# Altium schematic sheet GMSL_DESERIALIZER.SchDoc
size C; SheetNumber: 13; SheetTotal: 17
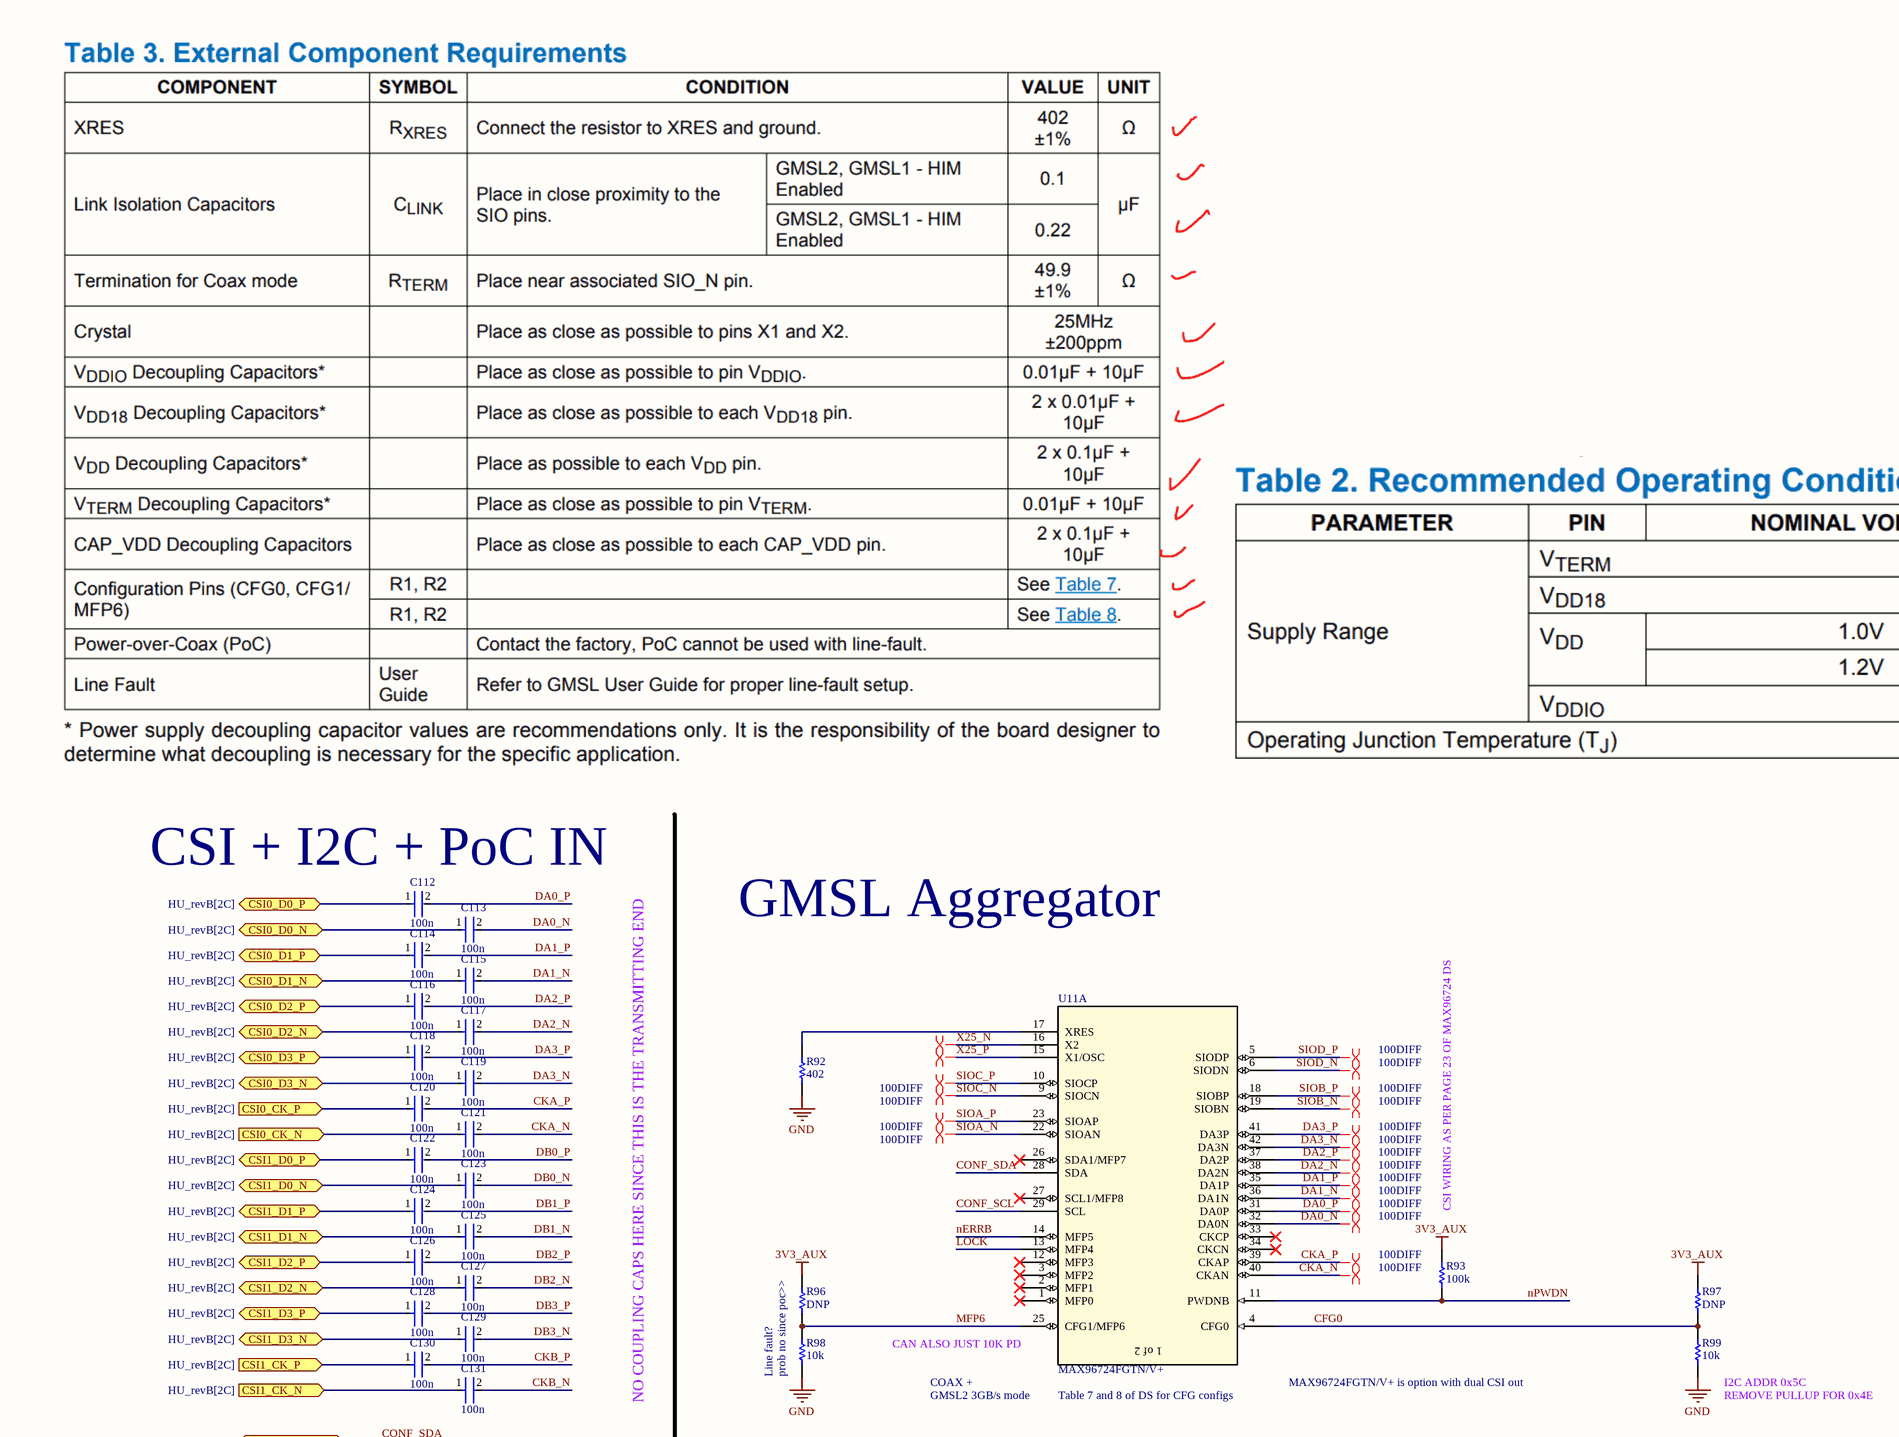
[diagram p0: GMSL_DESERIALIZER.SchDoc, top left]
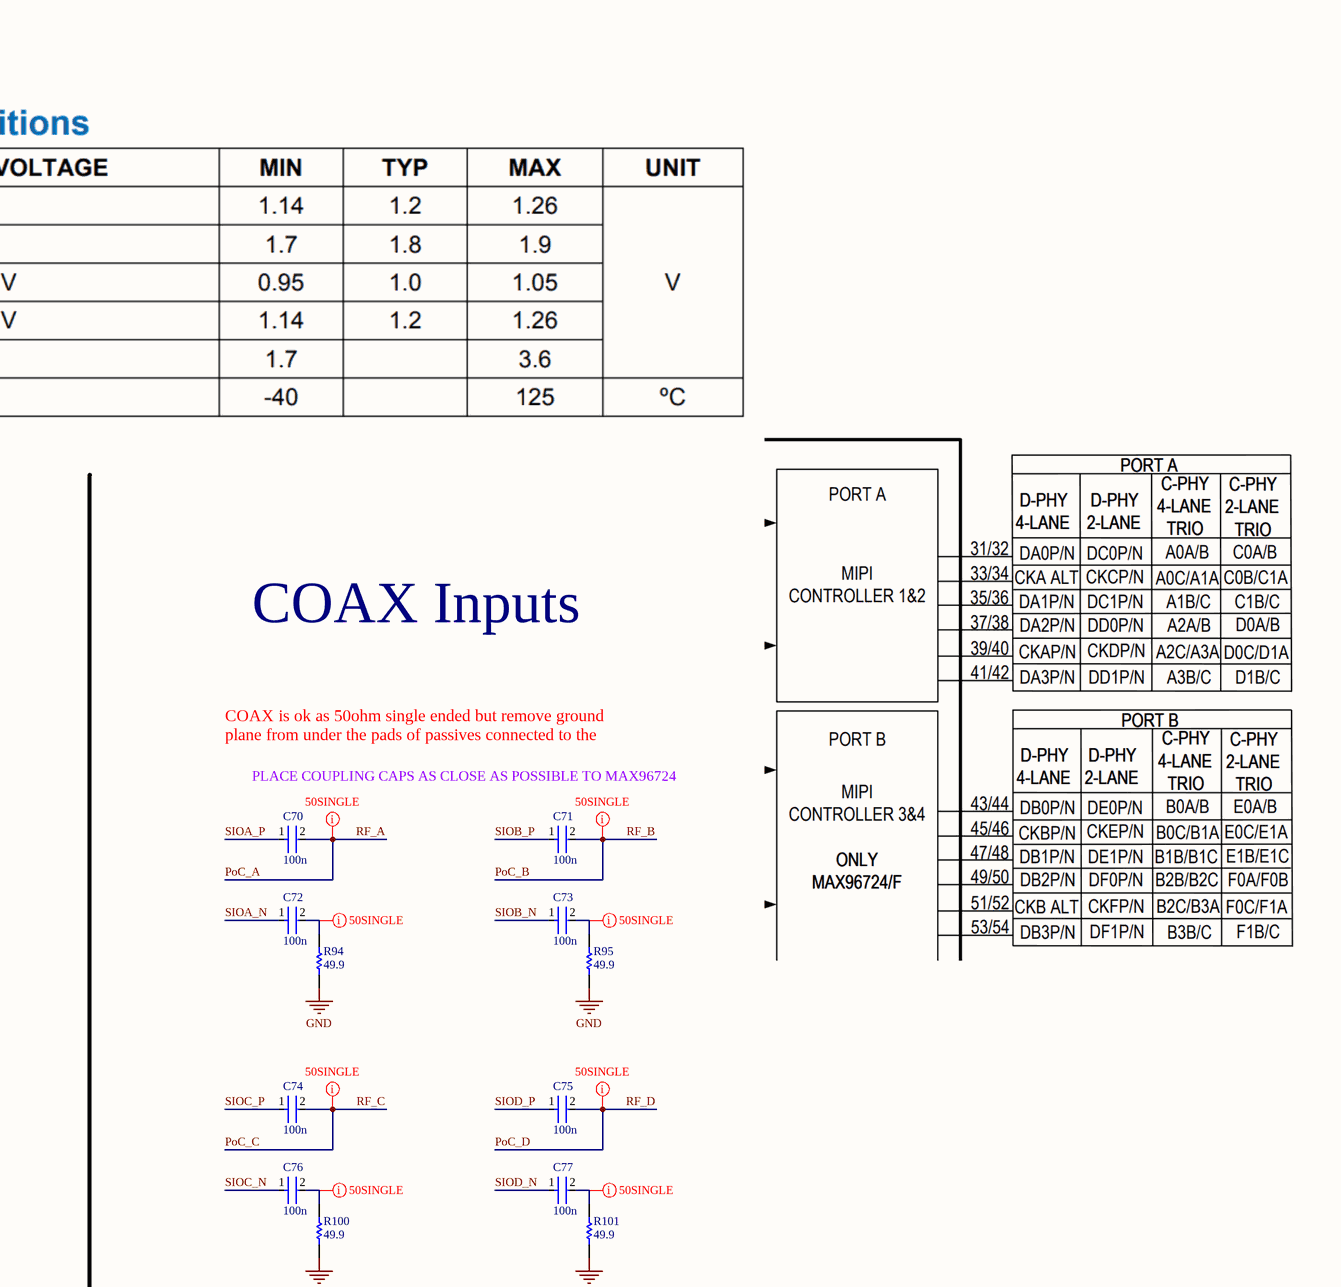
[diagram p1: GMSL_DESERIALIZER.SchDoc, top right]
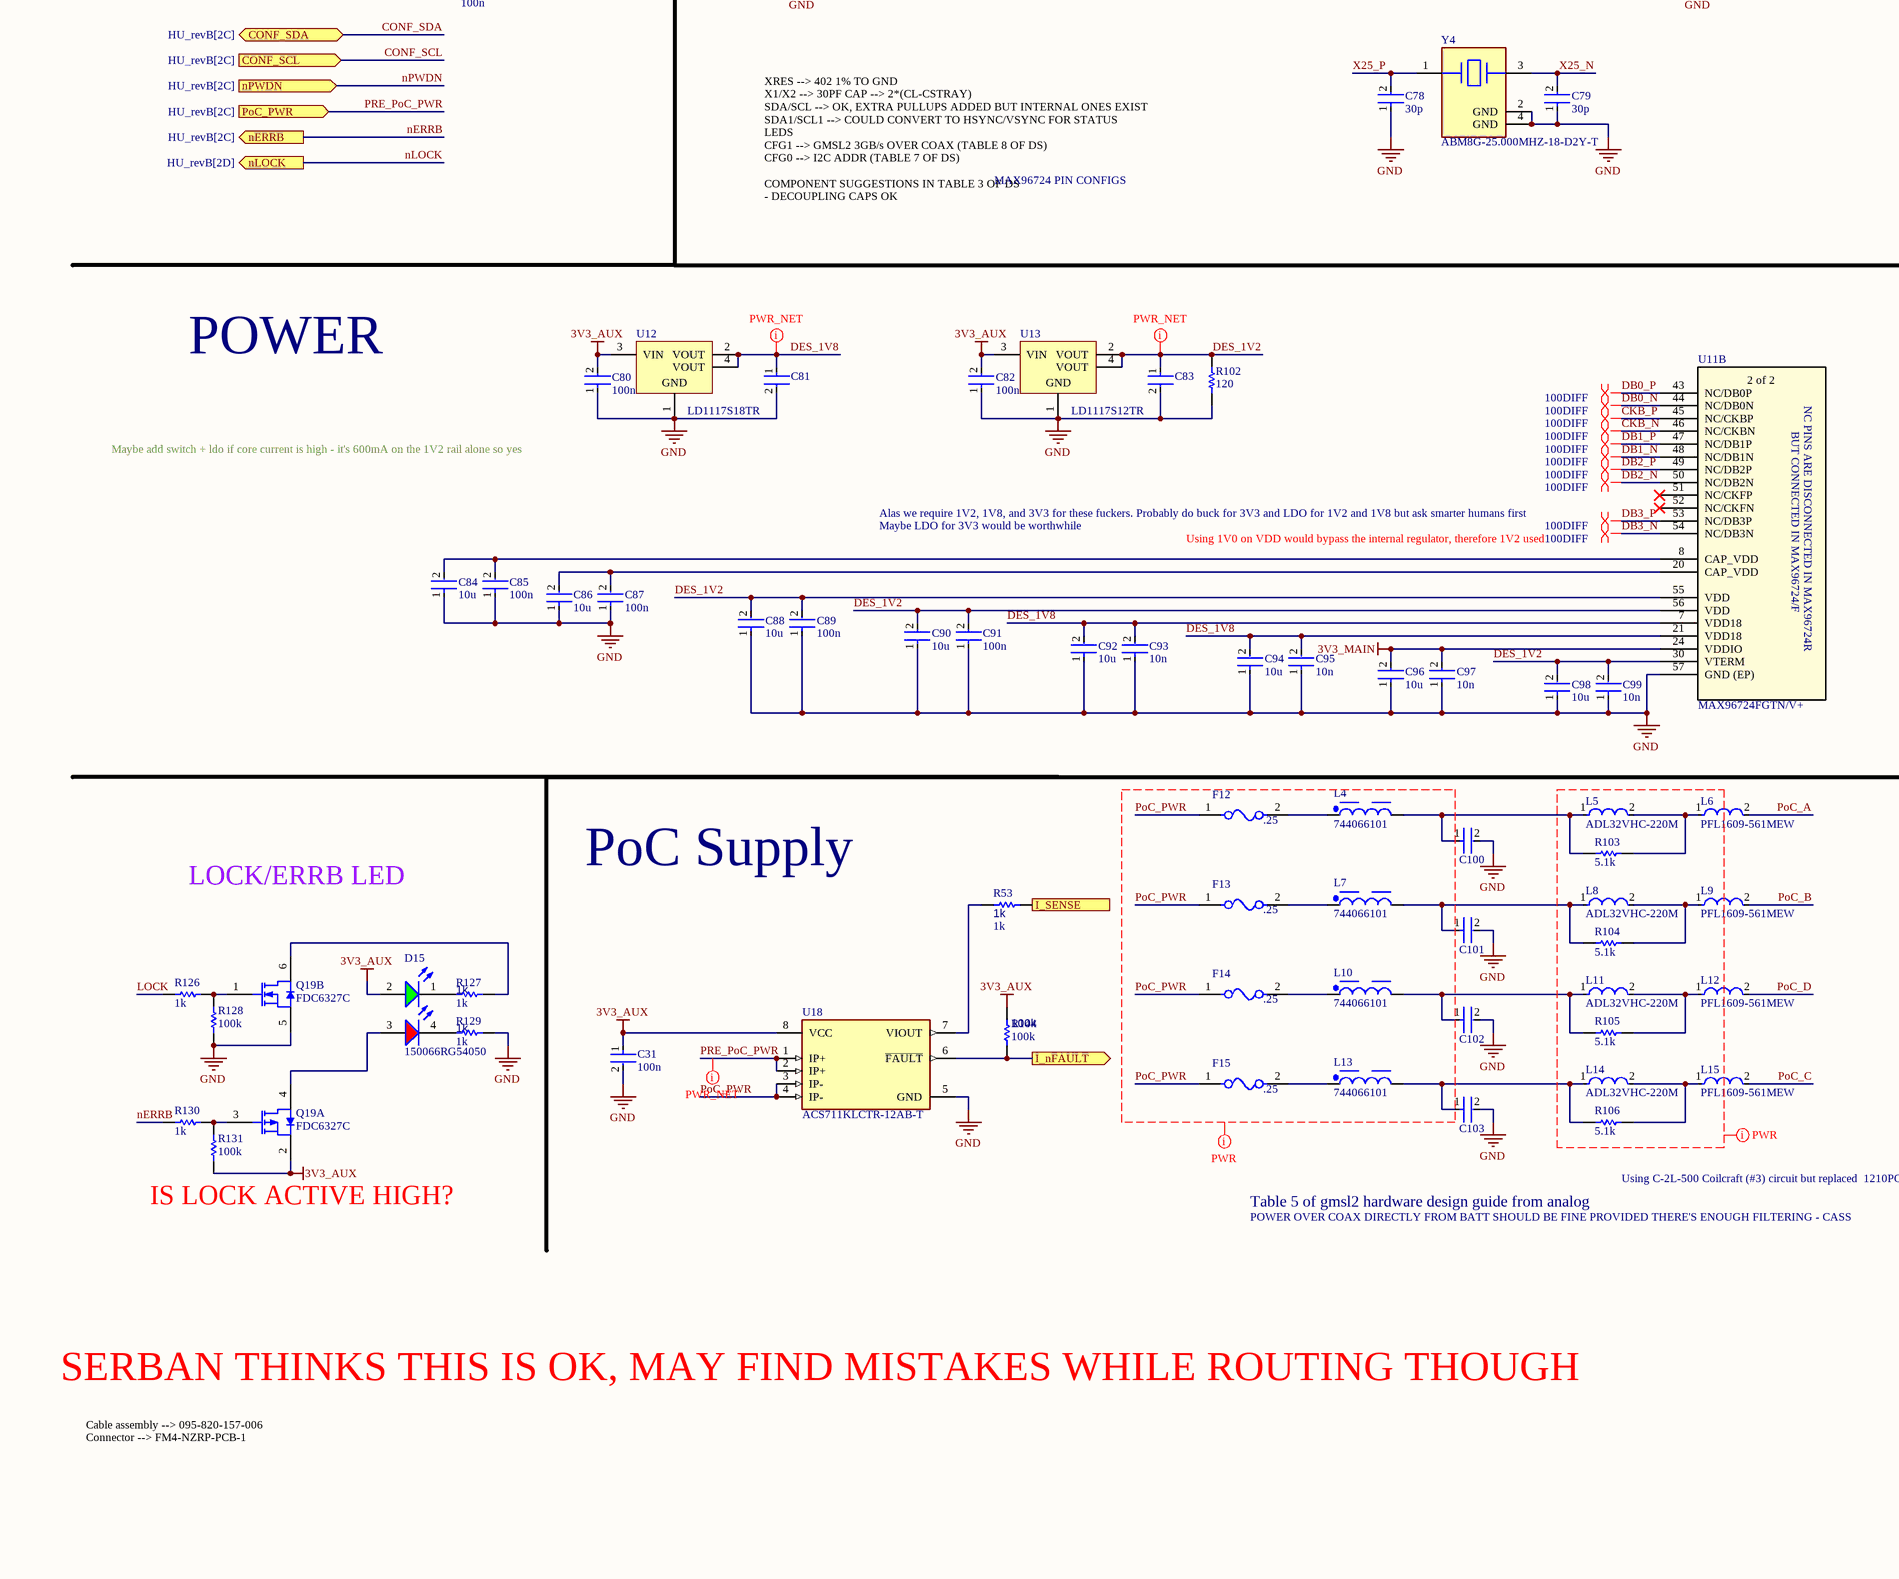
[diagram p2: GMSL_DESERIALIZER.SchDoc, bottom left]
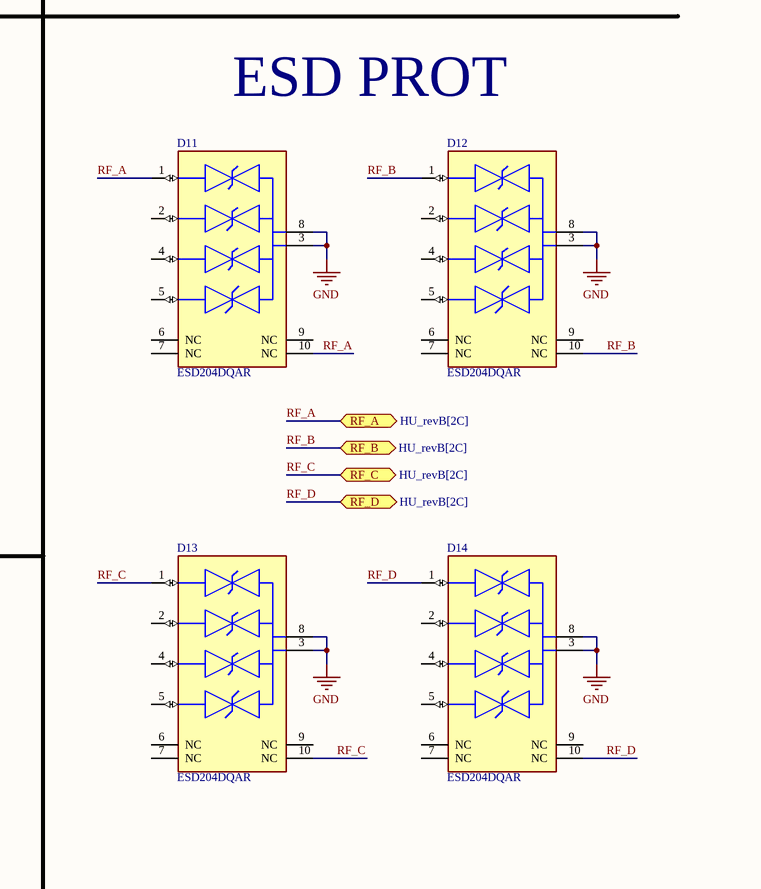
[diagram p3: GMSL_DESERIALIZER.SchDoc, bottom right]

## Parts
C31  100n  [FP-0402-L_1_0_0_05-W_0_5-IPC_A]
C70  100n  [FP-0402-L_1_0_0_05-W_0_5-IPC_A]
C71  100n  [FP-0402-L_1_0_0_05-W_0_5-IPC_A]
C72  100n  [FP-0402-L_1_0_0_05-W_0_5-IPC_A]
C73  100n  [FP-0402-L_1_0_0_05-W_0_5-IPC_A]
C74  100n  [FP-0402-L_1_0_0_05-W_0_5-IPC_A]
C75  100n  [FP-0402-L_1_0_0_05-W_0_5-IPC_A]
C76  100n  [FP-0402-L_1_0_0_05-W_0_5-IPC_A]
C77  100n  [FP-0402-L_1_0_0_05-W_0_5-IPC_A]
C78  30p  [FP-0402-L_1_0_0_05-W_0_5-IPC_A]
C79  30p  [FP-0402-L_1_0_0_05-W_0_5-IPC_A]
C80  100n  [FP-0402-L_1_0_0_05-W_0_5-IPC_A]
C81  GRM188R60J106ME47D  [FP-GRM188-0_1-e0_2_0_55-IPC_A]  (value not drawn)
C82  100n  [FP-0402-L_1_0_0_05-W_0_5-IPC_A]
C83  GRM188R60J106ME47D  [FP-GRM188-0_1-e0_2_0_55-IPC_A]  (value not drawn)
C84  10u  [FP-0402-L_1_0_0_05-W_0_5-IPC_A]
C85  100n  [FP-0402-L_1_0_0_05-W_0_5-IPC_A]
C86  10u  [FP-0402-L_1_0_0_05-W_0_5-IPC_A]
C87  100n  [FP-0402-L_1_0_0_05-W_0_5-IPC_A]
C88  10u  [FP-0402-L_1_0_0_05-W_0_5-IPC_A]
C89  100n  [FP-0402-L_1_0_0_05-W_0_5-IPC_A]
C90  10u  [FP-0402-L_1_0_0_05-W_0_5-IPC_A]
C91  100n  [FP-0402-L_1_0_0_05-W_0_5-IPC_A]
C92  10u  [FP-0402-L_1_0_0_05-W_0_5-IPC_A]
C93  10n  [FP-0402-L_1_0_0_05-W_0_5-IPC_A]
C94  10u  [FP-0402-L_1_0_0_05-W_0_5-IPC_A]
C95  10n  [FP-0402-L_1_0_0_05-W_0_5-IPC_A]
C96  10u  [FP-0402-L_1_0_0_05-W_0_5-IPC_A]
C97  10n  [FP-0402-L_1_0_0_05-W_0_5-IPC_A]
C98  10u  [FP-0402-L_1_0_0_05-W_0_5-IPC_A]
C99  10n  [FP-0402-L_1_0_0_05-W_0_5-IPC_A]
C100  GRM21BR61E226ME44L  [FP-GRM21B-0_2-e0_2_0_7-IPC_B]  (value not drawn)
C101  GRM21BR61E226ME44L  [FP-GRM21B-0_2-e0_2_0_7-IPC_B]  (value not drawn)
C102  GRM21BR61E226ME44L  [FP-GRM21B-0_2-e0_2_0_7-IPC_B]  (value not drawn)
C103  GRM21BR61E226ME44L  [FP-GRM21B-0_2-e0_2_0_7-IPC_B]  (value not drawn)
C112  100n  [FP-0402-L_1_0_0_05-W_0_5-IPC_A]
C113  100n  [FP-0402-L_1_0_0_05-W_0_5-IPC_A]
C114  100n  [FP-0402-L_1_0_0_05-W_0_5-IPC_A]
C115  100n  [FP-0402-L_1_0_0_05-W_0_5-IPC_A]
C116  100n  [FP-0402-L_1_0_0_05-W_0_5-IPC_A]
C117  100n  [FP-0402-L_1_0_0_05-W_0_5-IPC_A]
C118  100n  [FP-0402-L_1_0_0_05-W_0_5-IPC_A]
C119  100n  [FP-0402-L_1_0_0_05-W_0_5-IPC_A]
C120  100n  [FP-0402-L_1_0_0_05-W_0_5-IPC_A]
C121  100n  [FP-0402-L_1_0_0_05-W_0_5-IPC_A]
C122  100n  [FP-0402-L_1_0_0_05-W_0_5-IPC_A]
C123  100n  [FP-0402-L_1_0_0_05-W_0_5-IPC_A]
C124  100n  [FP-0402-L_1_0_0_05-W_0_5-IPC_A]
C125  100n  [FP-0402-L_1_0_0_05-W_0_5-IPC_A]
C126  100n  [FP-0402-L_1_0_0_05-W_0_5-IPC_A]
C127  100n  [FP-0402-L_1_0_0_05-W_0_5-IPC_A]
C128  100n  [FP-0402-L_1_0_0_05-W_0_5-IPC_A]
C129  100n  [FP-0402-L_1_0_0_05-W_0_5-IPC_A]
C130  100n  [FP-0402-L_1_0_0_05-W_0_5-IPC_A]
C131  100n  [FP-0402-L_1_0_0_05-W_0_5-IPC_A]
D11  ESD204DQAR  [FP-DQA0010A-MFG]
D12  ESD204DQAR  [FP-DQA0010A-MFG]
D13  ESD204DQAR  [FP-DQA0010A-MFG]
D14  ESD204DQAR  [FP-DQA0010A-MFG]
D15  150066RG54050  [WL-SBCD_0606]
F12  .25  [FP-0685T-MFG]
F13  .25  [FP-0685T-MFG]
F14  .25  [FP-0685T-MFG]
F15  .25  [FP-0685T-MFG]
L4  744066101  [WE-TPC_1038]
L5  ADL32VHC-220M  [FP-1210POC-MFG]
L6  PFL1609-561MEW  [FP-PFL1609-MFG]
L7  744066101  [WE-TPC_1038]
L8  ADL32VHC-220M  [FP-1210POC-MFG]
L9  PFL1609-561MEW  [FP-PFL1609-MFG]
L10  744066101  [WE-TPC_1038]
L11  ADL32VHC-220M  [FP-1210POC-MFG]
L12  PFL1609-561MEW  [FP-PFL1609-MFG]
L13  744066101  [WE-TPC_1038]
L14  ADL32VHC-220M  [FP-1210POC-MFG]
L15  PFL1609-561MEW  [FP-PFL1609-MFG]
Q19  FDC6327C  [FAIR-SOT23-6_V]  (parts A,B of 2)
R53  1k  [R0603B]
R92  402  [R0603B]
R93  100k  [R0603B]
R94  49.9  [R0603B]
R95  49.9  [R0603B]
R96  DNP  [R0603B]
R97  DNP  [R0603B]
R98  10k  [R0603B]
R99  10k  [R0603B]
R100  49.9  [R0603B]
R101  49.9  [R0603B]
R102  120  [R0603B]
R103  5.1k  [R0603B]
R104  5.1k  [R0603B]
R105  5.1k  [R0603B]
R106  5.1k  [R0603B]
R126  1k  [R0603B]
R127  1k  [R0603B]
R128  100k  [R0603B]
R129  1k  [R0603B]
R130  1k  [R0603B]
R131  100k  [R0603B]
R144  100k  [R0603B]
U11  MAX96724FGTN/V+  [MAX96724FGTN_V+-Footprint-1]  (parts A,B of 2)
U12  LD1117S18TR  [SOT-223_M]
U13  LD1117S12TR  [SOT-223_M]
U18  ACS711KLCTR-12AB-T  [FP-LC-8-IPC_C]
Y4  ABM8G-25.000MHZ-18-D2Y-T  [FP-ABM8G-MFG]

## Ports
CONF_SCL (in, see HU_revB[2C]), CONF_SDA (bidir, see HU_revB[2C]), CSI0_CK_N (in, see HU_revB[2C]), CSI0_CK_P (in, see HU_revB[2C]), CSI0_D0_N (bidir, see HU_revB[2C]), CSI0_D0_P (bidir, see HU_revB[2C]), CSI0_D1_N (bidir, see HU_revB[2C]), CSI0_D1_P (bidir, see HU_revB[2C]), CSI0_D2_N (bidir, see HU_revB[2C]), CSI0_D2_P (bidir, see HU_revB[2C]), CSI0_D3_N (bidir, see HU_revB[2C]), CSI0_D3_P (bidir, see HU_revB[2C]), CSI1_CK_N (in, see HU_revB[2C]), CSI1_CK_P (in, see HU_revB[2C]), CSI1_D0_N (bidir, see HU_revB[2C]), CSI1_D0_P (bidir, see HU_revB[2C]), CSI1_D1_N (bidir, see HU_revB[2C]), CSI1_D1_P (bidir, see HU_revB[2C]), CSI1_D2_N (bidir, see HU_revB[2C]), CSI1_D2_P (bidir, see HU_revB[2C]), CSI1_D3_N (bidir, see HU_revB[2C]), CSI1_D3_P (bidir, see HU_revB[2C]), I_nFAULT (out), I_SENSE (out), nERRB (out, see HU_revB[2C]), nLOCK (out, see HU_revB[2D]), nPWDN (in, see HU_revB[2C]), PoC_PWR (in, see HU_revB[2C]), RF_A (bidir, see HU_revB[2C]), RF_B (bidir, see HU_revB[2C]), RF_C (bidir, see HU_revB[2C]), RF_D (bidir, see HU_revB[2C])

## Nets
3V3_AUX: C31.1 C80.2 C82.2 D15.2(A) Q19.2(S) R93.2 R96.2 R97.2 R131.1 R144.2 U12.3(VIN) U13.3(VIN) U18.8(VCC)
3V3_MAIN: C96.2 C97.2 U11.24(VDDIO)
GND: C31.2 C78.1 C79.1 C80.1 C81.2 C82.1 C83.2 C84.1 C85.1 C86.1 C87.1 C88.1 C89.1 C90.1 C91.1 C92.1 C93.1 C94.1 C95.1 C96.1 C97.1 C98.1 C99.1 C100.2 C101.2 C102.2 C103.2 D11.3(GND) D11.8(GND) D12.3(GND) D12.8(GND) D13.3(GND) D13.8(GND) D14.3(GND) D14.8(GND) Q19.5(S) R92.1 R94.1 R95.1 R98.1 R99.1 R100.1 R101.1 R102.1 R128.2 R129.1 U11.57(GND_(EP)) U12.1(GND) U13.1(GND) U18.5(GND) Y4.2(GND) Y4.4(GND)
CFG0: R97.1 R99.2 U11.4(CFG0)
CKA_N: C121.2 U11.40(CKAN)
CKA_P: C120.2 U11.39(CKAP)
CKB_N: C131.2 U11.46(NC/CKBN)
CKB_P: C130.2 U11.45(NC/CKBP)
CONF_SCL: U11.29(SCL) ; port CONF_SCL
CONF_SDA: U11.28(SDA) ; port CONF_SDA
CSI0_CK_N: C121.1 ; port CSI0_CK_N
CSI0_CK_P: C120.1 ; port CSI0_CK_P
CSI0_D0_N: C113.1 ; port CSI0_D0_N
CSI0_D0_P: C112.1 ; port CSI0_D0_P
CSI0_D1_N: C115.1 ; port CSI0_D1_N
CSI0_D1_P: C114.1 ; port CSI0_D1_P
CSI0_D2_N: C117.1 ; port CSI0_D2_N
CSI0_D2_P: C116.1 ; port CSI0_D2_P
CSI0_D3_N: C119.1 ; port CSI0_D3_N
CSI0_D3_P: C118.1 ; port CSI0_D3_P
CSI1_CK_N: C131.1 ; port CSI1_CK_N
CSI1_CK_P: C130.1 ; port CSI1_CK_P
CSI1_D0_N: C123.1 ; port CSI1_D0_N
CSI1_D0_P: C122.1 ; port CSI1_D0_P
CSI1_D1_N: C125.1 ; port CSI1_D1_N
CSI1_D1_P: C124.1 ; port CSI1_D1_P
CSI1_D2_N: C127.1 ; port CSI1_D2_N
CSI1_D2_P: C126.1 ; port CSI1_D2_P
CSI1_D3_N: C129.1 ; port CSI1_D3_N
CSI1_D3_P: C128.1 ; port CSI1_D3_P
DA0_N: C113.2 U11.32(DA0N)
DA0_P: C112.2 U11.31(DA0P)
DA1_N: C115.2 U11.36(DA1N)
DA1_P: C114.2 U11.35(DA1P)
DA2_N: C117.2 U11.38(DA2N)
DA2_P: C116.2 U11.37(DA2P)
DA3_N: C119.2 U11.42(DA3N)
DA3_P: C118.2 U11.41(DA3P)
DB0_N: C123.2 U11.44(NC/DB0N)
DB0_P: C122.2 U11.43(NC/DB0P)
DB1_N: C125.2 U11.48(NC/DB1N)
DB1_P: C124.2 U11.47(NC/DB1P)
DB2_N: C127.2 U11.50(NC/DB2N)
DB2_P: C126.2 U11.49(NC/DB2P)
DB3_N: C129.2 U11.54(NC/DB3N)
DB3_P: C128.2 U11.53(NC/DB3P)
DES_1V2: C83.1 C88.2 C89.2 C90.2 C91.2 C98.2 C99.2 R102.2 U11.30(VTERM) U11.55(VDD) U11.56(VDD) U13.2(VOUT) U13.4(VOUT)
DES_1V8: C81.1 C92.2 C93.2 C94.2 C95.2 U11.7(VDD18) U11.21(VDD18) U12.2(VOUT) U12.4(VOUT)
I_nFAULT: R144.1 U18.6(~{FAULT}) ; port I_nFAULT
I_SENSE: R53.1 ; port I_SENSE
LOCK: R126.2 U11.13(MFP4)
MFP6: R96.1 R98.2 U11.25(CFG1/MFP6)
nERRB: R130.1 U11.14(MFP5) ; port nERRB
nLOCK: port nLOCK
nPWDN: R93.1 U11.11(PWDNB) ; port nPWDN
PoC_A: C70.2 D11.1(IO1) D11.10(NC) L6.2 ; port RF_A  [also labelled RF_A]
PoC_B: C71.2 D12.1(IO1) D12.10(NC) L9.2 ; port RF_B  [also labelled RF_B]
PoC_C: C74.2 D13.1(IO1) D13.10(NC) L15.2 ; port RF_C  [also labelled RF_C]
PoC_D: C75.2 D14.1(IO1) D14.10(NC) L12.2 ; port RF_D  [also labelled RF_D]
PoC_PWR: F12.1 F13.1 F14.1 F15.1 U18.3(IP-) U18.4(IP-)
PRE_PoC_PWR: U18.1(IP+) U18.2(IP+) ; port PoC_PWR
SIOA_N: C72.1 U11.22(SIOAN)
SIOA_P: C70.1 U11.23(SIOAP)
SIOB_N: C73.1 U11.19(SIOBN)
SIOB_P: C71.1 U11.18(SIOBP)
SIOC_N: C76.1 U11.9(SIOCN)
SIOC_P: C74.1 U11.10(SIOCP)
SIOD_N: C77.1 U11.6(SIODN)
SIOD_P: C75.1 U11.5(SIODP)
X25_N: C79.2 U11.16(X2) Y4.3
X25_P: C78.2 U11.15(X1/OSC) Y4.1
NetC72_2: C72.2 R94.2
NetC73_2: C73.2 R95.2
NetC76_2: C76.2 R100.2
NetC77_2: C77.2 R101.2
NetC84_2: C84.2 C85.2 U11.8(CAP_VDD)
NetC86_2: C86.2 C87.2 U11.20(CAP_VDD)
NetC100_1: C100.1 L4.2 L5.1 R103.2
NetC101_1: C101.1 L7.2 L8.1 R104.2
NetC102_1: C102.1 L10.2 L11.1 R105.2
NetC103_1: C103.1 L13.2 L14.1 R106.2
NetD15_1: D15.1(K) R127.2
NetD15_3: D15.3(A) Q19.4(D)
NetD15_4: D15.4(K) R129.2
NetF12_2: F12.2 L4.1
NetF13_2: F13.2 L7.1
NetF14_2: F14.2 L10.1
NetF15_2: F15.2 L13.1
NetL5_2: L5.2 L6.1 R103.1
NetL8_2: L8.2 L9.1 R104.1
NetL11_2: L11.2 L12.1 R105.1
NetL14_2: L14.2 L15.1 R106.1
NetQ19_1: Q19.1(G) R126.1 R128.1
NetQ19_3: Q19.3(G) R130.2 R131.2
NetQ19_6: Q19.6(D) R127.1
NetR53_2: R53.2 U18.7(VIOUT)
NetR92_2: R92.2 U11.17(XRES)

Not connected (* = marked no-connect by the designer): D11 2(IO2) 4(IO3) 5(IO4) 6(NC) 7(NC) 9(NC); D12 2(IO2) 4(IO3) 5(IO4) 6(NC) 7(NC) 9(NC); D13 2(IO2) 4(IO3) 5(IO4) 6(NC) 7(NC) 9(NC); D14 2(IO2) 4(IO3) 5(IO4) 6(NC) 7(NC) 9(NC); U11 1(MFP0)* 2(MFP1)* 3(MFP2)* 12(MFP3)* 26(SDA1/MFP7)* 27(SCL1/MFP8)* 33(CKCP)* 34(CKCN)* 51(NC/CKFP)* 52(NC/CKFN)*

## Layout directives
differential pair: X25_N, X25_P
net class PWR: (no net found under the mark), DES_1V2, DES_1V8, PoC_PWR, PRE_PoC_PWR
net class 50SINGLE: NetC72_2, NetC73_2, NetC76_2, NetC77_2, PoC_A, PoC_B, PoC_C, PoC_D
differential pair; differential pair class 100DIFF: CKA_N, CKA_P, CKB_N, CKB_P, DA0_N, DA0_P, DA1_N, DA1_P, DA2_N, DA2_P, DA3_N, DA3_P, DB0_N, DB0_P, DB1_N, DB1_P, DB2_N, DB2_P, DB3_N, DB3_P, SIOA_N, SIOA_P, SIOB_N, SIOB_P, SIOC_N, SIOC_P, SIOD_N, SIOD_P

## Notes on the sheet
- (near C112) CSI + I2C + PoC IN
- GMSL Aggregator
- COAX Inputs
- COAX is ok as 50ohm single ended but remove ground plane from under the pads of passives connected to the GMSL trace
- PLACE COUPLING CAPS AS CLOSE AS POSSIBLE TO MAX96724
- CSI WIRING AS PER PAGE 23 OF MAX96724 DS
- Line fault?
- prob no since poc>>
- CAN ALSO JUST 10K PD
- NO COUPLING CAPS HERE SINCE THIS IS THE TRANSMITTING END
- GMSL2 3GB/s mode
- COAX +
- Table 7 and 8 of DS for CFG configs
- MAX96724FGTN/V+ is option with dual CSI out
- (near R99) I2C ADDR 0x5C
- (near R99) REMOVE PULLUP FOR 0x4E
- XRES --> 402 1% TO GND
  X1/X2 --> 30PF CAP --> 2*(CL-CSTRAY)
  SDA/SCL --> OK, EXTRA PULLUPS ADDED BUT INTERNAL ONES EXIST
  SDA1/SCL1 --> COULD CONVERT TO HSYNC/VSYNC FOR STATUS LEDS
  CFG1 --> GMSL2 3GB/s OVER COAX (TABLE 8 OF DS)
  CFG0 --> I2C ADDR (TABLE 7 OF DS)
  COMPONENT SUGGESTIONS IN TABLE 3 OF DS
  - DECOUPLING CAPS OK
- MAX96724 PIN CONFIGS
- ESD PROT
- POWER
- Maybe add switch + ldo if core current is high - it's 600mA on the 1V2 rail alone so yes
- Alas we require 1V2, 1V8, and 3V3 for these fuckers. Probably do buck for 3V3 and LDO for 1V2 and 1V8 but ask smarter humans first
- Maybe LDO for 3V3 would be worthwhile
- Using 1V0 on VDD would bypass the internal regulator, therefore 1V2 used
- LOCK/ERRB LED
- PoC Supply
- Using C-2L-500 Coilcraft (#3) circuit but replaced  1210POC-223
- (near R131) IS LOCK ACTIVE HIGH?
- Table 5 of gmsl2 hardware design guide from analog
- POWER OVER COAX DIRECTLY FROM BATT SHOULD BE FINE PROVIDED THERE'S ENOUGH FILTERING - CASS
- SERBAN THINKS THIS IS OK, MAY FIND MISTAKES WHILE ROUTING THOUGH
- Cable assembly --> 095-820-157-006
  Connector --> FM4-NZRP-PCB-1
- (in symbol CMP-015-00011-2, part A) 1 of 2
- (in symbol CMP-015-00011-2, part B) 2 of 2; NC PINS ARE DISCONNECTED IN MAX96724R; BUT CONNECTED IN MAX96724/F

## Library data of the parts
C31 C70-C80 C82 C84-C99 C112-C131 = CMP-001-00058-1: LARGE PADS, 0402 CAP, CHANGE COMMENT TO MATCH REAL P/N; Capacitor Type: Ceramic; Min Operating Temperature: -55°C; Mounting Technology: Surface Mount; Pins: 2; Case/Package: 0402; RoHS Compliant: Yes; Max Operating Temperature: 85°C
C81 C83 = CMP-2006-02792-2: Chip Multilayer Ceramic Capacitors for General Purpose, 0603, 10uF, X5R, 15%, 20%, 6.3V; Packaging: Tape and Reel; Voltage Rating (DC): 6.3V; Width: 0.031inch; Termination: SMD/SMT; Dielectric: X5R; Package Quantity: 4000; Voltage Rating: 6.3V; Capacitance: 10uF; Case/Package: 0603; Min Operating Temperature: -55°C; Voltage: 6.3V; Length: 1.6mm; Thickness: 0.035inch; Lead Free: Lead Free; Depth: 0.8mm; Case Code (Imperial): 0603; Max Operating Temperature: 85°C; Material: Ceramic; Height: 0.8mm; Tolerance: 20%; Mount: Surface Mount; REACH SVHC: No SVHC; Radiation Hardening: No; Case Code (Metric): 1608
C100-C103 = CMP-2007-03222-3: Chip Multilayer Ceramic Capacitors for General Purpose, 0805, 22uF, X5R, 15%, 20%, 25V; Case/Package: 0805; Depth: 1.25mm; Resistor Type: Ceramic; Voltage Rating: 25V; Lead Free: Lead Free; Voltage Rating (DC): 25V; Case Code (Metric): 2012; Thickness: 0.057inch; REACH SVHC: No SVHC; Material: Ceramic; Tolerance: 20%; Length: 2mm; Capacitance: 22uF; Case Code (Imperial): 0805; Max Operating Temperature: 85°C; Termination: SMD/SMT; Weight: 0.000335oz; Dielectric: X5R; Packaging: Tape and Reel; Voltage: 25V; Package Quantity: 3000; Height: 1.25mm; Mount: Surface Mount; Width: 1.25mm; Min Operating Temperature: -55°C
D11-D14 = CMP-04989-000002-1: 4-CHANNEL LOW-CAPACITANCE SURGE; Manufacturer: Texas Instruments; Value: 0.55pF; Reverse Standoff Voltage: 3.6V; Standoff Height: 0mm; Breakdown Voltage: 5.5V; Peak Pulse Current: 5.5A; Clamping Voltage: 11.5V; Direction: Bidirectional; Peak Pulse Power: 50W; Number Of Channels: 4; Ambient Temperature Range High: +125°C; ComponentLink2Description: Datasheet; Height: 0.55mm; Lead Free: Yes; Device Class L3: unset; Temperature Range High: +125°C; Temperature Range Low: -40°C; Package: DQA0010A; Temperature: -40°C to +125°C; Capacitance: 0.55pF; RoHS: TRUE; Mouser Description: 4-Channel Low-Capacitance Surge and ESD Protection Diode 10-USON -40 to 125; Category: Diode; Device Class L1: Circuit Protection; Octopart: https://octopart.com/esd204dqar-texas+instruments-89917476; Device Class L2: TVS Diodes; Ambient Temperature Range Low: -40°C; Manufacturer Part Number: ESD204DQAR; ComponentLink2URL: http://www.ti.com/lit/ds/symlink/esd204.pdf; Automotive: No; Digikey Description: 4-CHANNEL LOW-CAPACITANCE SURGE
D15 = CMP-004-00040-2: Led, Red/Grn, 180Mcd/230Mcd, 624Nm/525Nm Rohs Compliant: Yes; Source: rgled.SchLib; Component Type: Standard; Design Item ID: CMP-004-00034-2; Pins: 4
F12-F15 = CMP-16042-000006-1: FUSE BOARD MNT 5A 63VAC/VDC 1206; RoHS Compliant: Yes
L4 L7 L10 L13 = CMP-0227-00094-3: NexarPartId: 8917123; Current Rating: 1.2A; Shielding: Shielded; Core Material: Ferrite; Inductance: 100µH; Test Frequency: 100kHz; Tolerance: 30%; Resistance: 255mΩ; Self Resonant Frequency: 6MHz; Composition: Wirewound; Packaging: Cut Tape (CT); REACH SVHC: Unknown; Number of Pins: 2; Max DC Current: 1.2A; Saturation Current: 1.2A; Ambient Temperature Range High: 95°C; Weight: 1.273007g; Height: 3.8mm; Width: 10mm; Min Operating Temperature: -40°C; Max Operating Temperature: 125°C; Termination: SMD/SMT; Height - Seated (Max): 4.0894mm; Length: 10mm; RMS Current (Irms): 1.2A; Ambient Temperature Range Low: -40°C; RoHS: Compliant; Mount: Surface Mount; Depth: 10mm; DC Resistance (DCR): 255mΩ; Inductance Tolerance: 30%; Case/Package: Nonstandard
L5 L8 L11 L14 = CMP-11268-000041-1: NOT COILCRAFT - ACTUAL P# --> ADL32VHC-220M / - Power Injection Chokes for PoC; Manufacturer Part Number: 1210POC-223MRC; Value: 22uH; Core Material: Ferrite; Saturation Current: 720mA; Series Resistance: 0.88Ω; Rms Current: 700mA; Automotive Grade: Grade 1; Self Resonant Frequency: 70MHz; Test Frequency: 100kHz; Tolerance: 20%; Ambient Temperature Range High: +125°C; Manufacturer: coilcraft; Octopart: https://octopart.com/1210poc-223mrc-coilcraft-103207315; Category: Ind; Device Class L2: Inductors; RoHS: TRUE; Device Class L3: Fixed Inductors; Package: 1210POC; Ambient Temperature Range Low: -40°C; ComponentLink2URL: https://drive.google.com/open?id=15FlOq8Y4YbRFohfA_cJ40jgnqs8va2Mh; Lead Free: Yes; Inductance: 22uH; Device Class L1: Passive Components; ComponentLink2Description: Datasheet; Automotive: Yes; Height: 3mm
L6 L9 L12 L15 = CMP-11268-000007-1: Fixed Inductors PFL1609 Low Profile 0.56 uH 20 % 1.4 A; Manufacturer: coilcraft; Rms Current: 1100mA; Self Resonant Frequency: 600MHz; Core Material: Composite; Tolerance: 20%; Value: 0.56uH; Automotive Grade: Grade 1; Saturation Current: 710mA; Test Frequency: 7.9MHz; Shielding: true; Series Resistance: 130mΩ; Lead Free: Yes; Device Class L1: Passive Components; Package: PFL1609; Octopart: https://octopart.com/pfl1609-561mew-coilcraft-20329171; ComponentLink2URL: https://www.coilcraft.com/pdfs/pfl1609.pdf; Manufacturer Part Number: PFL1609-561MEW; Ambient Temperature Range Low: -40°C; Composition: Wirewound; Inductance: 0.56uH; Device Class L2: Inductors; Category: Ind; Device Class L3: Fixed Inductors; Mouser Description: Fixed Inductors PFL1609 Low Profile 0.56 uH 20 % 1.4 A; Automotive: Yes; ComponentLink2Description: Datasheet; Ambient Temperature Range High: +105°C; Height: 0.95mm; RoHS: TRUE
Q19 = CMP-2000-04939-1: Dual N & P-Channel 2.5 V Specified PowerTrench(TM) MOSFET, -55 to 150 degC, 6-Pin SOT-23, RoHS, Tape and Reel; Manufacturer: Fairchild; Typical Rise Time: 9@NChannel; Rad Hard: No; Maximum Drain Source Voltage: 20V; Typical Fall Time: 3@NChannel; Typical Turn-On Delay Time: 5@NChannel; Maximum Continuous Drain Current: 2.7@NChannel; Typical Turn-Off Delay Time: 12@NChannel; RDS-on: 80@4.5V@NChannel; Channel Mode: Enhancement; Maximum Gate Source Voltage: ±8V; Package Version: Rev. 5, 05/2015; Operating Temperature: -55to150degC; Packaging: Tape&Reel; Package Reference: SOT23-6; Package URL: https://www.fairchildsemi.com/package-drawings/MA/MA06A.pdf; Package Description: 6-Pin Small Outline Transistor, Body 2.9 x 1.6 mm, Pitch 0.95 mm; Manufacturer URL: https://www.fairchildsemi.com/; Channel Type: N; Datasheet Version: Rev. E, 07/2000; Package: 6SuperSOT; Datasheet URL: https://www.fairchildsemi.com/datasheets/FD/FDC6327C.pdf; Mounting: SurfaceMount; Category: MOSFET
R53 R92-R106 R126-R131 R144 = CMP-009-00002-14: Resistor
  R53 R127 R129: Value: 1k
  R144: Value: 100k
U11 = CMP-015-00011-2: Quad Tunneling GMSL2/1 to CSI-2 Deserializer
U12 = CMP-0244-00308-1: Fixed Low Drop Positive Voltage Regulator, 1.8V, 4-Pin SOT-223, Tape and Reel; ComponentLink1URL: http://www.st.com; PackageReference: SOT-223; PackageDescription: 4-Pin SOT-223 Package, 6.5 x 3.5 mm Body, 2.3 mm Pitch, 7 mm Lead Span; ComponentLink2URL: http://www.st.com/internet/com/TECHNICAL_RESOURCES/TECHNICAL_LITERATURE/DATASHEET/CD00000544.pdf; ComponentLink2Description: Datasheet; ComponentLink1Description: Manufacturer URL; DatasheetVersion: 1/11/2011; PackageVersion: 2010
U13 = CMP-0244-00318-1: Fixed Low Drop Positive Voltage Regulator, 1.2V, 4-Pin SOT-223, Tape and Reel; PackageDescription: 4-Pin SOT-223 Package, 6.5 x 3.5 mm Body, 2.3 mm Pitch, 7 mm Lead Span; PackageVersion: 2010; ComponentLink2Description: Datasheet; PackageReference: SOT-223; ComponentLink2URL: http://www.st.com/internet/com/TECHNICAL_RESOURCES/TECHNICAL_LITERATURE/DATASHEET/CD00000544.pdf; ComponentLink1Description: Manufacturer URL; DatasheetVersion: 1/11/2011; ComponentLink1URL: http://www.st.com
U18 = CMP-1557-00012-2: SENSOR CURRENT HALL 12.5A AC/DC; Number of Channels: 1; Min Supply Voltage: 3V; Sensitivity: 110mV/A; Response Time: 4.6us; Operating Supply Voltage: 3.3V; Max Supply Voltage: 5.5V; Max Supply Current: 5.5mA; Bandwidth: 100kHz; Linearity: 1%; Quiescent Current: 4mA; Accuracy: 5%; Polarity: Bidirectional; Case/Package: SOIC; Packaging: Tape and Reel; Number of Pins: 8; Width: 3.9mm; Frequency: 100kHz; -3db Bandwidth: 100kHz; REACH SVHC: No SVHC; Series: -; Height: 1.5mm; Package Quantity: 1; Min Operating Temperature: -40°C; Max Operating Temperature: 125°C; Current Sensing: 12.5A; RoHS Compliant: Yes; Length: 4.9mm
Y4 = CMP-2000-05733-3: Crystal 25MHz ±20ppm (Tol) ±30ppm (Stability) 18pF FUND 60Ω 4-Pin SMD T/R; Series Resistance: 60R; Length: 3.2mm; Depth: 2.5mm; Packaging: Tape and Reel; Min Operating Temperature: -40°C; Operating Frequency: 25 MHz; Lead Free: Lead Free; Number of Pins: 4; Frequency Tolerance: 20ppm; Radiation Hardening: No; Max Operating Temperature: 85°C; Termination: SMD/SMT; Frequency Stability: 30ppm; Frequency: 25MHz; Series: ABM8G; Mount: Surface Mount; Package Quantity: 1000; Height: 0.039inch; Width: 0.098inch; Case/Package: CSMD; ESR (Equivalent Series Resistance): 60R; Load Capacitance: 18pF; Tolerance: 20ppm